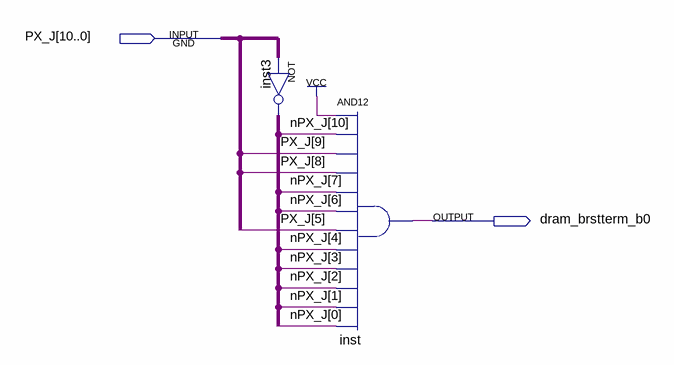
[diagram p0: schematic sheet]
// Quartus schematic dram_brstterm_b0.bdf as structural Verilog: 2 symbols, 2 pins
module dram_brstterm_b0 (
  input  [10:0] PX_J,
  output dram_brstterm_b0
);

  wire [10:0] nPX_J;

  assign nPX_J = ~PX_J;  // NOT inst3, 11 bits wide
  and inst (dram_brstterm_b0, 1'b1, nPX_J[10], PX_J[9], PX_J[8], nPX_J[7], nPX_J[6], PX_J[5], nPX_J[4], nPX_J[3], nPX_J[2], nPX_J[1], nPX_J[0]);
endmodule
